# Altium schematic sheet 4-20mA Transmitter-XTR117.SCHDOC
size 431 x 279 mm; Date: Not shown in title block; ApprovedBy: Not shown in title block; CheckedBy: Not shown in title block; Author: Not shown in title block; CompanyName: Not shown in title block; Engineer: Not shown in title block; Organization: Not shown in title block; Address1: Not shown in title block; Address2: Not shown in title block; Address3: Not shown in title block; Address4: Not shown in title block; DocumentNumber: 1; Revision: Use project parameter SCH_Rev; SheetNumber: 1; SheetTotal: 1; PageSetup: Record=PageOptions|CenterHorizontal=True|CenterVertical=True|PrintScale=1.00|XCorrection=1.00|YCorrection=1.00|PrintKind=0|BorderSize=5000000|LeftOffset=0|BottomOffset=0|Orientation=2|PaperLength=1000|PaperWidth=1000|Scale=100|PaperSource=15|PrintQuality=600|MediaType=1|DitherType=10|PaperKind=Letter|PrintScaleMode=1; CurrentTime: Not shown in title block; CurrentDate: Not shown in title block; Time: Not shown in title block; DocumentFullPathAndName: Not shown in title block; DocumentName: Not shown in title block; ModifiedDate: Not shown in title block; ImagePath: Not shown in title block
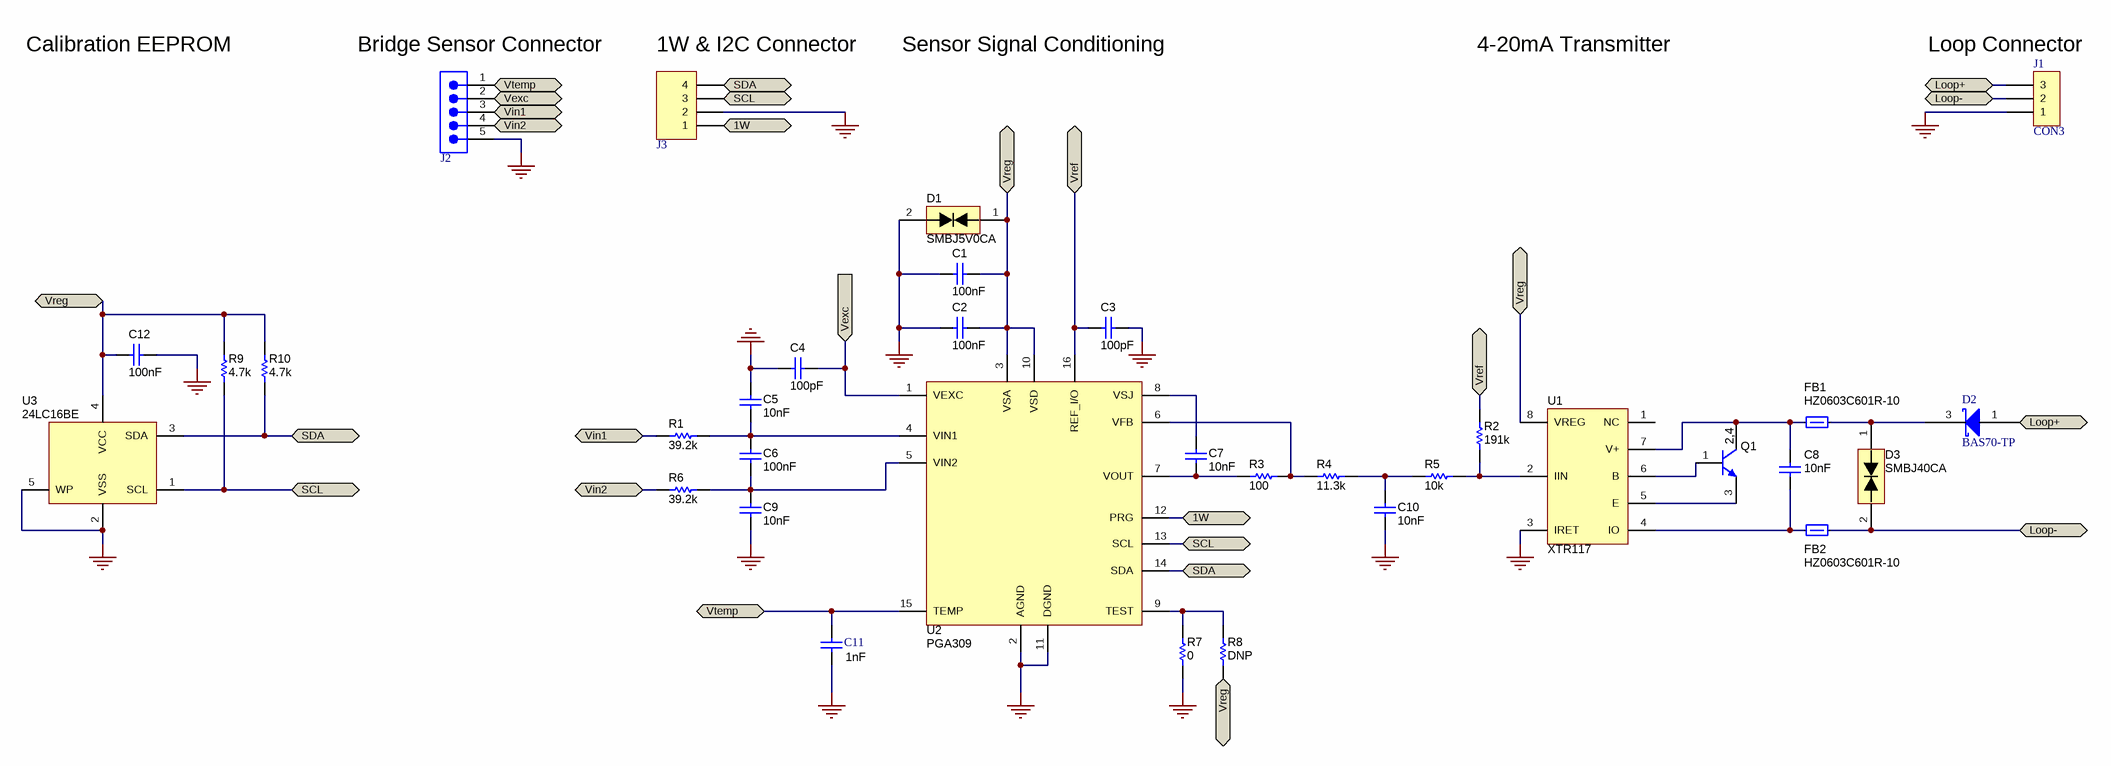
[diagram p0: 4-20mA Transmitter-XTR117.SCHDOC]

## Parts
C1  value 100nF  [CR1005-0402]  (hidden comment: Used in BOM report)
C2  value 100nF  [CR1005-0402]  (hidden comment: Used in BOM report)
C3  value 100pF  [CR1005-0402]  (hidden comment: Used in BOM report)
C4  value 100pF  [CR1005-0402]  (hidden comment: Used in BOM report)
C5  value 10nF  [CR1005-0402]  (hidden comment: Used in BOM report)
C6  value 100nF  [CR1005-0402]  (hidden comment: Used in BOM report)
C7  value 10nF  [CR1005-0402]  (hidden comment: Used in BOM report)
C8  value 10nF  [CR1608-0603]  (hidden comment: Used in BOM report)
C9  value 10nF  [CR1005-0402]  (hidden comment: Used in BOM report)
C10  value 10nF  [CR1005-0402]  (hidden comment: Used in BOM report)
C11  value 1nF  [CR1005-0402]  (hidden comment: Used in BOM report)
C12  value 100nF  [CR1005-0402]  (hidden comment: Used in BOM report)
D1  SMBJ5V0CA  [SMB]
D2  BAS70-TP  [SOT23-3]
D3  SMBJ40CA  [SMB]
FB1  value HZ0603C601R-10  [CR1608-0603]  (hidden comment: Used in BOM report)
FB2  value HZ0603C601R-10  [CR1608-0603]  (hidden comment: Used in BOM report)
J1  CON3  [SIP3]
J2  TSW-105-07-G-S  [SIP5]  (value not drawn)
J3  1W & I2C Connector  [HDR1X4]
Q1  FCX690BTA  [SOT89]  (value not drawn)
R1  value 39.2k  [CR1005-0402]  (hidden comment: Used in BOM report)
R2  value 191k  [CR1005-0402]  (hidden comment: Used in BOM report)
R3  value 100  [CR1005-0402]  (hidden comment: Used in BOM report)
R4  value 11.3k  [CR1005-0402]  (hidden comment: Used in BOM report)
R5  value 10k  [CR1005-0402]  (hidden comment: Used in BOM report)
R6  value 39.2k  [CR1005-0402]  (hidden comment: Used in BOM report)
R7  value 0  [CR1005-0402]  (hidden comment: Used in BOM report)
R8  value DNP  [CR1005-0402]  (hidden comment: Used in BOM report)
R9  value 4.7k  [CR1005-0402]  (hidden comment: Used in BOM report)
R10  value 4.7k  [CR1005-0402]  (hidden comment: Used in BOM report)
U1  XTR117  [MSOP8]
U2  PGA309  [TSSOP16]
U3  24LC16BE  [SOT23-5]

## Ports
1W, Loop+, Loop-, SCL, SDA, Vexc, Vin1, Vin2, Vref, Vreg, Vtemp

## Nets
GND: C1.1 C2.1 C3.2 C4.1 C5.1 C9.2 C10.2 C11.2 C12.2 D1.2 J1.1 J2.5 J3.2 R7.1 U1.3(IRET) U2.2(AGND) U2.11(DGND) U3.2(VSS) U3.5(WP)
1W: J3.1 U2.12(PRG) ; port 1W
Loop+: D2.1(IN) J1.3 ; port Loop+
Loop-: D3.2 FB2.2 J1.2 ; port Loop-
SCL: J3.3 R9.1 U2.13(SCL) U3.1(SCL) ; port SCL
SDA: J3.4 R10.1 U2.14(SDA) U3.3(SDA) ; port SDA
Vexc: C4.2 J2.2 U2.1(VEXC) ; port Vexc
Vin1: J2.3 R1.1 ; port Vin1
Vin2: J2.4 R6.1 ; port Vin2
Vref: C3.1 R2.1 U2.16(REF_I/O) ; port Vref
Vreg: C1.2 C2.2 C12.1 D1.1 R8.1 R9.2 R10.2 U1.8(VREG) U2.3(VSA) U2.10(VSD) U3.4(VCC) ; port Vreg
Vtemp: C11.1 J2.1 U2.15(TEMP) ; port Vtemp
NetC5_2: C5.2 C6.1 R1.2 U2.4(VIN1)
NetC6_2: C6.2 C9.1 R6.2 U2.5(VIN2)
NetC7_1: C7.1 U2.8(VSJ)
NetC7_2: C7.2 R3.2 U2.7(VOUT)
NetC8_1: C8.1 FB1.1 Q1.2(C) U1.7(V+)
NetC8_2: C8.2 FB2.1 U1.4(IO)
NetC10_1: C10.1 R4.1 R5.2
NetD2_3: D2.3(OUT) D3.1 FB1.2
NetQ1_1: Q1.1(B) U1.6(B)
NetQ1_3: Q1.3(E) U1.5(E)
NetR2_2: R2.2 R5.1 U1.2(IIN)
NetR3_1: R3.1 R4.2 U2.6(VFB)
NetR7_2: R7.2 R8.2 U2.9(TEST)

Not connected (* = marked no-connect by the designer): U1 1(NC)

## Notes on the sheet
- Calibration EEPROM
- (near J2) Bridge Sensor Connector
- Sensor Signal Conditioning
- 4-20mA Transmitter
- (near J1) Loop Connector
- Drawn By:
- SVN Rev:
- Number:
- Rev:
- Sheet Title:
- File:
- Project Title:
- Designed for:
- Assembly Variant:
- Mod. Date:
- Sheet:
- Size:
- of
- B
- http://www.ti.com
- Texas Instruments and/or its licensors do not warrant the accuracy or completeness of this specification or any information contained therein. Texas Instruments and/or its licensors do not warrant that this design will meet the specifications, will be suitable for your application or fit for any particular purpose, or will operate in an implementation. Texas Instruments and/or its licensors do not warrant that the design is production worthy. You should completely validate and test your design implementation to confirm the system functionality for your application.
- Engineer:
- Contact:
- ?Texas Instruments
- (in symbol FCX690BTA, Diodes Inc.) 2,4

## Library data of the parts
C1-C12 = Capacitor: CAP, CERM, xxxF, xxV, [TempCo], xx%, [PackageReference]; Polarized: N; U/M: EA; CompType: Capacitor; SymbolVersion: 2008-07-09; PackageReference: Used in PnP output; Manufacturer: Used in BOM report; PartNumber: Used in BOM report; RoHS: Used in BOM report.  Use Y or N.; MountType: SMT or TH (used in PnP report); ComponentLink1Description: Datasheet Link; ComponentLink1URL: Paste URL for datasheet here; Publisher: Texas Instruments; LatestRevisionNote: Added Alternate PartNumber and Alternate Manufacturer parameters to appropriate components.; Alternate Manufacturer: -; Alternate PartNumber: -
  C1-C10 C12: LatestRevisionDate: 2012-08-27
  C11: LatestRevisionDate: 2012-11-28
D1 D3 = TVS_BI_SMB: Manufacturer: Used in BOM report; SymbolVersion: use current date i.e. 2008-05-20; SymbolCreator: Use a-id; CompType: Used in some BOM reports.  Useful for finding later.; U/M: EA, IN, or GM; MountType: SMT, TH, or N/A; RoHS: Used in BOM report.  Use Y or N.; PartNumber: Used in BOM report; PackageReference: eg:  0603, used in PnP report; ComponentLink1Description: Datasheet Link; Alternate PartNumber: -; Alternate Manufacturer: -
D2 = Component_1
FB1 FB2 = Ferrite_Bead: 300mA Ferrite Bead, 600 ohm @ 100MHz; U/M: EA; CompType: Used in BOM report; SymbolVersion: 2009-06-02; PackageReference: Used in PnP output; Manufacturer: Used in BOM report; PartNumber: Used in BOM report; RoHS: Used in BOM report.  Use Y or N.; MountType: SMT or TH (used in PnP report); ComponentLink1Description: Datasheet Link; ComponentLink1URL: Paste URL for datasheet here; Publisher: Texas Instruments; LatestRevisionDate: 2012-08-27; LatestRevisionNote: Added Alternate PartNumber and Alternate Manufacturer parameters to appropriate components.; Alternate Manufacturer: -; Alternate PartNumber: -
J1 = CON3: Connector
J2 = TSW-105-07-G-S: Header, TH, 100mil, 5x1, Gold plated, 230 mil above insulator; Manufacturer: Samtec, Inc.; U/M: EA; PartNumber: TSW-105-07-G-S; ClassName: Header; CompType: Header; RoHS: Y; PackageReference: TSW-105-07-G-S; MountType: TH; ComponentLink1Description: Datasheet Link; ComponentLink1URL: http://samtec.com/ftppub/pdf/TSW_TH.PDF; Publisher: Texas Instruments; LatestRevisionDate: 2013-01-15; LatestRevisionNote: Added parts, moved some to Hardware.IntLib; Supplier 1: Digi-Key; Supplier Part Number 1: SAM1029-05-ND
J3 = Header 4: Header, 4-Pin; LatestRevisionDate: 17-Jul-2002; LatestRevisionNote: Re-released for DXP Platform.; Publisher: Altium Limited
Q1 = FCX690BTA, Diodes Inc.: Transistor, NPN, 45V, 1A, SOT-89; Alternate Manufacturer: None; CompType: BJT; U/M: EA; PNP: 0; NPN: 1; Vceo_V: 45; Vcesat1_V: 0.08; Value: 0.08V; SymbolVersion: 2009-09-01; MountType: SMT; PartNumber: FCX690BTA; Manufacturer: Diodes Inc.; PackageReference: SOT-89; RoHS: Y; IcRated_A: 1; Value1: 1A; Published: 2008-07-31; LatestRevisionDate: 2012-07-20; LatestRevisionNote: Removed DigiKeyPartNumber parameter.; Publisher: Texas Instruments; ComponentLink1Description: Datasheet link; ComponentLink1URL: http://www.diodes.com/datasheets/FCX690B.pdf; Alternate PartNumber: None; Supplier 1: Digi-Key; Supplier Part Number 1: FCX690BCT-ND; Supplier 2: Arrow; Supplier Part Number 2: FCX690BTA
R1-R10 = Resistor: RES, xxx ohm, x%, xW, [PackageReference]; U/M: EA; CompType: Resistor; SymbolVersion: 2009-05-29; PackageReference: Used in PnP output; Manufacturer: Used in BOM report; PartNumber: Used in BOM report; RoHS: Used in BOM report.  Use Y or N.; MountType: SMT or TH (used in PnP report); ComponentLink1Description: Datasheet Link; ComponentLink1URL: Paste URL for datasheet here; Publisher: Texas Instruments; LatestRevisionDate: 2012-08-27; LatestRevisionNote: Added Alternate PartNumber and Alternate Manufacturer parameters to appropriate components.; Alternate Manufacturer: -; Alternate PartNumber: -
U1 = XTR117_MSOP: Manufacturer: Used in BOM report; SymbolVersion: use current date i.e. 2008-05-20; SymbolCreator: Use a-id; CompType: Used in some BOM reports.  Useful for finding later.; U/M: EA, IN, or GM; MountType: SMT, TH, or N/A; RoHS: Used in BOM report.  Use Y or N.; PartNumber: Used in BOM report; PackageReference: eg:  0603, used in PnP report; ComponentLink1Description: Datasheet Link; Alternate PartNumber: -; Alternate Manufacturer: -
U2 = PGA309_TSSOP16: Manufacturer: Used in BOM report; SymbolVersion: use current date i.e. 2008-05-20; SymbolCreator: Use a-id; CompType: Used in some BOM reports.  Useful for finding later.; U/M: EA, IN, or GM; MountType: SMT, TH, or N/A; RoHS: Used in BOM report.  Use Y or N.; PartNumber: Used in BOM report; PackageReference: eg:  0603, used in PnP report; ComponentLink1Description: Datasheet Link; Alternate PartNumber: -; Alternate Manufacturer: -
U3 = 24LC16BE_SOT-23: Manufacturer: Used in BOM report; SymbolVersion: use current date i.e. 2008-05-20; SymbolCreator: Use a-id; CompType: Used in some BOM reports.  Useful for finding later.; U/M: EA, IN, or GM; MountType: SMT, TH, or N/A; RoHS: Used in BOM report.  Use Y or N.; PartNumber: Used in BOM report; PackageReference: eg:  0603, used in PnP report; ComponentLink1Description: Datasheet Link; Alternate PartNumber: -; Alternate Manufacturer: -